# Altium schematic sheet Micro.SchDoc
size Letter
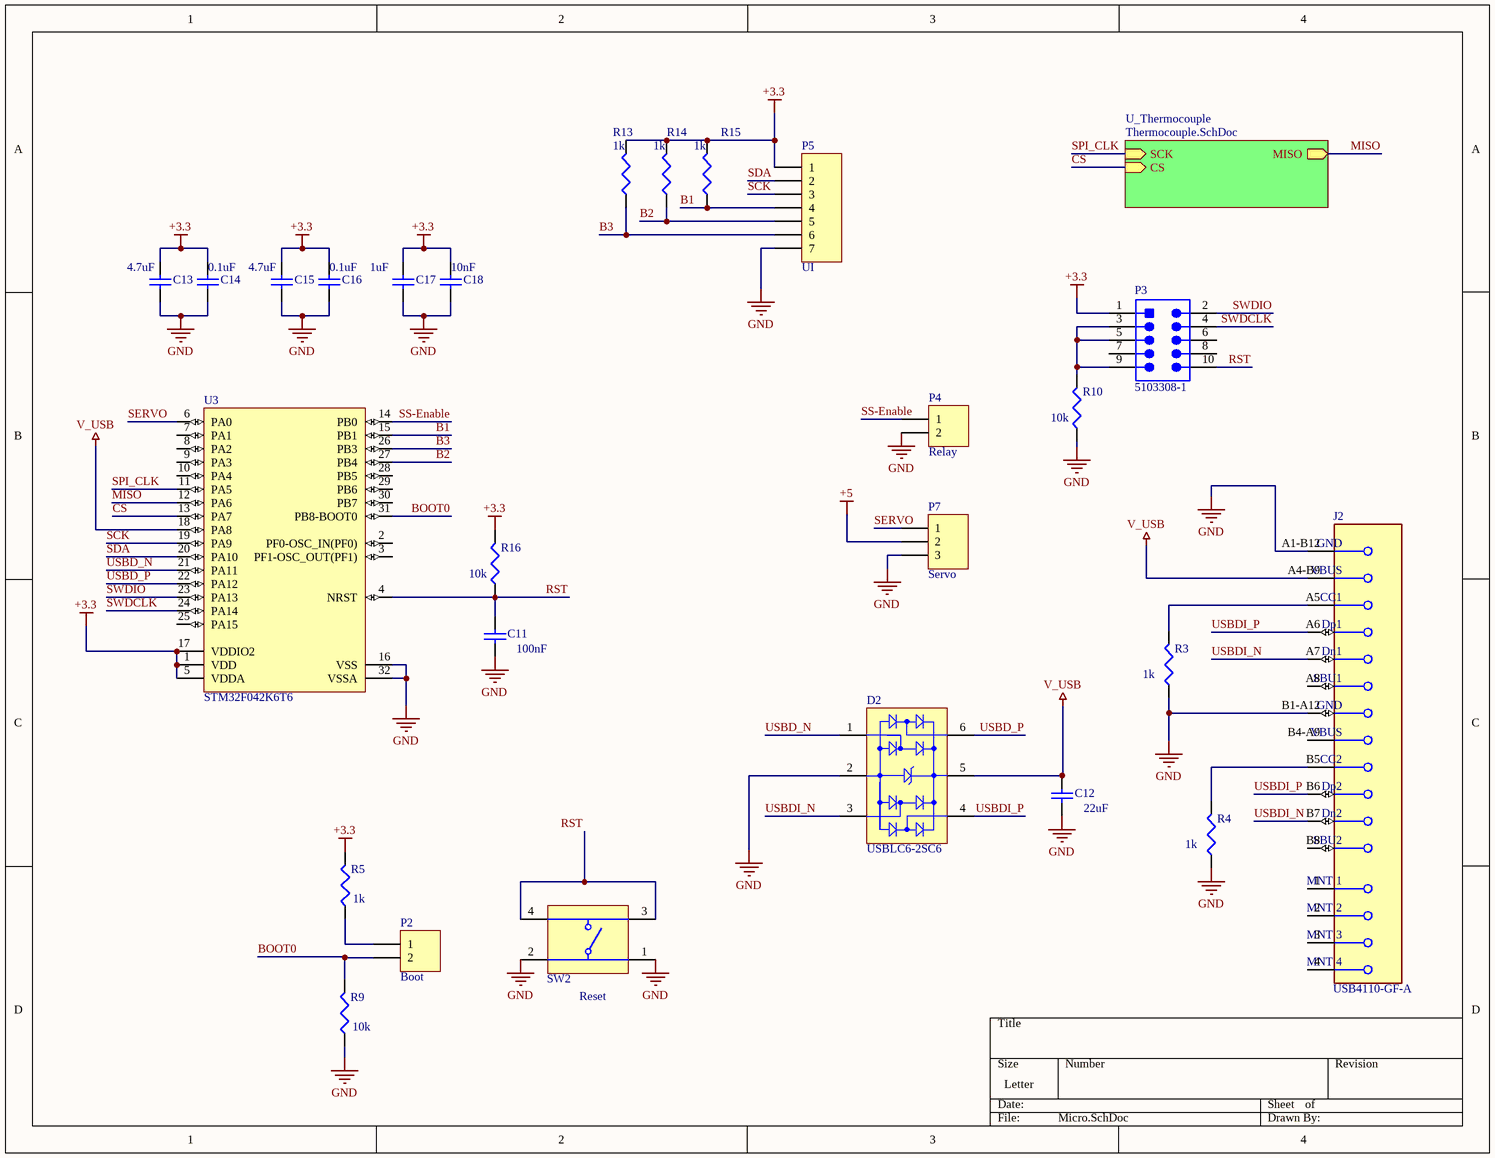
[diagram p0: Micro.SchDoc]

## Parts
C11  value 100nF  [1608[0603]]  (hidden comment: Cap Semi)
C12  value 22uF  [1608[0603]]  (hidden comment: Cap Semi)
C13  value 4.7uF  [1608[0603]]  (hidden comment: Cap Semi)
C14  value 0.1uF  [1608[0603]]  (hidden comment: Cap Semi)
C15  value 4.7uF  [1608[0603]]  (hidden comment: Cap Semi)
C16  value 0.1uF  [1608[0603]]  (hidden comment: Cap Semi)
C17  value 1uF  [1608[0603]]  (hidden comment: Cap Semi)
C18  value 10nF  [1608[0603]]  (hidden comment: Cap Semi)
D2  USBLC6-2SC6  [STM-SOT23-6L_V]
J2  USB4110-GF-A  [FP-USB4110-GF-A-MFG]
P2  Boot  [HDR1X2]
P3  5103308-1  [TECO-5103308-1_V]
P4  Relay  [HDR1X2H]
P5  UI  [HDR1X7H]
P7  Servo  [HDR1X3H]
R3  value 1k  [J1-0603]  (hidden comment: Res3)
R4  value 1k  [J1-0603]  (hidden comment: Res3)
R5  value 1k  [J1-0603]  (hidden comment: Res3)
R9  value 10k  [J1-0603]  (hidden comment: Res3)
R10  value 10k  [J1-0603]  (hidden comment: Res3)
R13  value 1k  [J1-0603]  (hidden comment: Res3)
R14  value 1k  [J1-0603]  (hidden comment: Res3)
R15  value 1k  [J1-0603]  (hidden comment: Res3)
R16  value 10k  [J1-0603]  (hidden comment: Res3)
SW2  Reset  [CKCP-PTS525SM10SMTR-4_V]
U3  STM32F042K6T6  [STM-LQFP32_M]

## Sub-sheets
U_Thermocouple = Thermocouple.SchDoc: SCK (in), MISO (out), CS (in)

## Nets
+3.3: C13.2 C14.2 C15.2 C16.2 C17.2 C18.2 P3.1 P5.1 R5.2 R13.2 R14.2 R15.2 R16.2 U3.1(VDD) U3.5(VDDA) U3.17(VDDIO2)
+5: P7.2
GND: C11.1 C12.1 C13.1 C14.1 C15.1 C16.1 C17.1 C18.1 D2.2(GND) J2.A1-B12(GND) J2.B1-A12(GND) P4.2 P5.7 P7.3 R3.1 R4.1 R9.1 R10.1 SW2.1 SW2.2 U3.16(VSS) U3.32(VSSA)
V_USB: C12.2 D2.5(VBUS) J2.A4-B9(VBUS) U3.18(PA8)
B1: P5.4 R15.1 U3.15(PB1)
B2: P5.5 R14.1 U3.27(PB4)
B3: P5.6 R13.1 U3.26(PB3)
BOOT0: P2.2 R9.2 U3.31(PB8-BOOT0)
CS: U3.13(PA7) ; sheet U_Thermocouple/CS
MISO: U3.12(PA6) ; sheet U_Thermocouple/MISO
RST: C11.2 P3.10 R16.1 SW2.3 SW2.4 U3.4(NRST)
SCK: P5.3 U3.19(PA9)
SDA: P5.2 U3.20(PA10)
SERVO: P7.1 U3.6(PA0)
SPI_CLK: U3.11(PA5) ; sheet U_Thermocouple/SCK
SS-Enable: P4.1 U3.14(PB0)
SWDCLK: P3.4 U3.24(PA14)
SWDIO: P3.2 U3.23(PA13)
USBD_N: D2.1(I/O_1) U3.21(PA11)
USBD_P: D2.6(I/O_4) U3.22(PA12)
USBDI_N: D2.3(I/O_2) J2.A7(Dn1) J2.B7(Dn2)
USBDI_P: D2.4(I/O_3) J2.A6(Dp1) J2.B6(Dp2)
NetJ2_A5: J2.A5(CC1) R3.2
NetJ2_B5: J2.B5(CC2) R4.2
NetP2_1: P2.1 R5.1
NetP3_3: P3.3 P3.5 P3.9 R10.2

Not connected (* = marked no-connect by the designer): J2 1(MNT_1) 2(MNT_2) 3(MNT_3) 4(MNT_4) A8(SBU1) B4-A9(VBUS) B8(SBU2); P3 6 7 8; U3 2(PF0-OSC_IN(PF0)) 3(PF1-OSC_OUT(PF1)) 7(PA1) 8(PA2) 9(PA3) 10(PA4) 25(PA15) 28(PB5) 29(PB6) 30(PB7)

## Library data of the parts
C11 C12 = Cap Semi_3: Capacitor (Semiconductor SIM Model); Published: 8-Jun-2000; LatestRevisionDate: 29-May-2009; LatestRevisionNote: IPC-7351 Footprint Added.; PackageReference: C1206; Publisher: Altium Limited; PackageDescription: Chip Capacitor; LCSC Part #: C14663
C13 C15 C17 = Cap Semi_1: Capacitor (Semiconductor SIM Model); Published: 8-Jun-2000; LatestRevisionDate: 29-May-2009; LatestRevisionNote: IPC-7351 Footprint Added.; PackageReference: C1206; Publisher: Altium Limited; PackageDescription: Chip Capacitor; LCSC Part #: C15849
C14 C16 C18 = Cap Semi_2: Capacitor (Semiconductor SIM Model); Published: 8-Jun-2000; LatestRevisionDate: 29-May-2009; LatestRevisionNote: IPC-7351 Footprint Added.; PackageReference: C1206; Publisher: Altium Limited; PackageDescription: Chip Capacitor; LCSC Part #: C15195
D2 = CMP-2000-05378-1: Very low capacitance ESD protection, 3.5 pF, -40 to 125 degC, 6-Pin SOT23, RoHS, Tape and Reel; Manufacturer: STMicroelectronics; Polarity: Uni-Directional; Clamping Voltage: 17V; Rad Hardened: No; Product Height (mm): 1.3mm; Leakage Current (Max): 0.15uA; Product Length (mm): 3.05mm; Number of Elements: 1; Peak Pulse Current: 5A; Configuration: Dual; Reverse Breakdown Voltage: 6V; Working Voltage (Max): 5V; Capacitance Value: 3.5pF; Suppressor Type: DiodeArrays; Product Depth (mm): 1.75mm; Test Current (It): 1mA; Package / Case: SOT-23; Operating Temperature Max Deg. C: 125C; Package Description: 6-Pin Small Outline Transistor, Body 2.925 x 1.625 mm, Pitch 0.95 mm; Package Reference: SOT23-6L; Datasheet Version: Rev. 5, 10/2011; Operating Temperature Min Deg. C: -40C; Mounting Style: SurfaceMount; Direction Type: Uni-Directional; Mounting: SurfaceMount; Pin Count: 6; Leakage Current: 0.15uA; Packaging: TapeandReel; Operating Temperature Classification: Automotive; Clamping Voltage (Max): 17V; Manufacturer URL: http://www.st.com/; Reverse Stand-off Voltage: 5V; Datasheet URL: http://www.st.com/st-web-ui/static/active/en/resource/technical/document/datasheet/CD00050750.pdf; Working Voltage: 5V; Operating Temp Range: -40Cto125C
J2 = CMP-245163-000002-1: CONN USB 2.0 TYPE-C R/A SMT; Manufacturer: GCT; Conn Orientation: Right Angle; Usb Standard: USB 2.0; Voltage Rating: 20V; Current Rating: 3/4.25/1.25/0.25A; Number Of Contacts: 16; Is Female: yes; Shielding: true; Standoff Height: 0.1mm; Octopart: https://octopart.com/usb4110-gf-a-gct-103941985; Temperature: -40°C to +85°C; RoHS: TRUE; Automotive: No; Contact Material: Gold,Nickel; Device Class L1: Connectors; Device Class L2: USB Connectors; Package: 0; Lead Free: Yes; ComponentLink2URL: https://gct.co/files/drawings/usb4110.pdf; Temperature Range High: +85°C; Temperature Range Low: -40°C; Height: 3.46mm; Manufacturer Part Number: USB4110-GF-A; ComponentLink2Description: Datasheet; Device Class L3: unset; Digikey Description: CONN USB 2.0 TYPE-C R/A SMT; Category: Conn
P2 = Header 2: Header, 2-Pin; LatestRevisionDate: 17-Jul-2002; LatestRevisionNote: Re-released for DXP Platform.; Publisher: Altium Limited
P3 = CMP-2000-05416-1: Male Header, Pitch 2.54 mm, 2 x 5 Position, Height 9.85 mm, Tail Length 3.05 mm, RoHS, Tube; Manufacturer: TE Connectivity; Pitch: 0.100"(2.54mm); Mating Products: 1658624-1-ND / -CONNRCPT10POSPOLARGOLD / 1658527-4-ND / -CONNRCPT10POS.100W/STRRELF / 1658527-3-ND / -CONNRCPT10POS.100622SERIES / 1658526-3-ND / -CONNRCPT10POSVERTGOLD / 1658526-5-ND / -609-1041LFFEMSOCKT,LEADFREE / 1658526-4-ND / -609-1030LFFEMSOCKT,LEADFREE / ASC10B-ND / -CONNIDCSOCKET10POSGOLD / ASC10H-ND / -CONNIDCSOCKET10POS15GOLD / AKC10B-ND / -CONNIDCSKT10POSW/POLGOLD / AKC10H-ND / -CONNIDCSKT10POSW/POL15GOLD / More...; Dynamic Catalog: AMP-LatchSeries; Number of Positions Loaded: All; Featured Product: AMP-LATCHRibbonCableConnectors; 3D Model: 5103308-1.pdf; Number of Positions: 10; Other Names: A33159; Catalog Drawings: LowProfileShroudedStraight; Connector Type: Header,Shrouded; Termination: Solder; Contact Finish Thickness: 15µin(0.38µm); Datasheet URL: http://www.onlinecomponents.com/productFiles/mf-AMP/eng_cat_889409_0699_96_.pdf; Standard Package: 125; Number of Rows: 2; Contact Type: MalePin; Mounting Type: ThroughHole; Manufacturer URL: http://www.te.com/; Contact Finish: GoldorGold-Palladium; Family: RectangularConnectors-Headers,MalePins; RoHS Information: 5103308-1StatementofCompliance; Packaging: Tube; Category: Connectors,Interconnects; Datasheet Version: Apr-12; Contact Mating Length: 0.240"(6.10mm); Series: AMP-Latch; Row Spacing: 0.100"(2.54mm); Color: Black
P4 = Header 2H: Header, 2-Pin, Right Angle; LatestRevisionDate: 17-Jul-2002; LatestRevisionNote: Re-released for DXP Platform.; Publisher: Altium Limited
P5 = Header 7H: Header, 7-Pin, Right Angle; LatestRevisionDate: 17-Jul-2002; LatestRevisionNote: Re-released for DXP Platform.; Publisher: Altium Limited
P7 = Header 3H: Header, 3-Pin, Right Angle; LatestRevisionDate: 17-Jul-2002; LatestRevisionNote: Re-released for DXP Platform.; Publisher: Altium Limited
R3-R5 R9 R10 R13-R16 = Res3_2: Resistor; Published: 8-Jun-2000; LatestRevisionDate: 29-May-2009; LatestRevisionNote: IPC-7351 Footprint Added.; PackageReference: J1-0603; Publisher: Altium Limited; PackageDescription: Chip Resistor; LCSC Part #: C25804
SW2 = CMP-2000-05088-1: Microminiature Tact Switch, SPST-NO, 50 mA, 12 VDC, -40 to 60 degC, 4-Pin SMD, RoHS, Tape and Reel; Part No: PTS525SM10SMTRLFS; Manufacturer: C&K Components; Maximum DC Voltage Rating: 12V; Body Orientation: Straight; Dielectric Strength: 250VAC; Pole Throw Configuration: SPST; Operating Force: 1.57N; Minimum Insulation Resistance: 100000MOhm; Actuator Length: 0.3mm; Base Material: Nylon6/6,Glass/Polyester; Switch Configuration: N.O.; Contact Rating @ Voltage: 0.05@12VDCA; Ground Terminal: No; Mechanical Life: 100000Cycles; Actuator Style: RoundButton; Illumination Type: N/R; Maximum Contact Resistance: 100mOhm; Datasheet Version: Apr-09; Contact Material: PhosphorBronze; Dimension: 5.25x6.4x1.5mm; Family: PTS525; Type: N/A; Seal Description: N/A; Mounting: SurfaceMount,GullWing; Product Weight: N/A; Seal Location: N/A; Electrical Life: N/A; Manufacturer URL: http://www.ckswitches.com/; Datasheet URL: https://datasheet.ciiva.com/18145/getdatasheetpartid-226915-18145102.pdf; Maximum AC Voltage Rating: N/A; Supplier: C&KComponents; HTS: 8536501199; Contact Plating: SilverClad; Actuator Color: N/A; Operating Temperature: -40to60C; ECCN: EAR99; Supplier Standard Pack: 3,000; RoHS: Yes; Housing Material: N/A; Packaging: TapeandReel
U3 = CMP-0304-00114-2: ARM Cortex-M0 32-bit MCU, 32 KB Flash, 6 KB Internal RAM, 28 I/Os, 32-Pin LQFP, -40 to 85 degC, Tray; Manufacturer: STMicroelectronics; Operating Frequency(F) (Processor speed) (MHz): 48; Internal RAM Size (kB): 6; Supply Voltage(Vcc) min (V): 2; I/Os (High Current): 28; FLASH Size (Prog) (kB): 32; ComponentLink1Description: Manufacturer URL; Package Reference: LQFP32; ComponentLink2Description: Datasheet; ComponentLink1URL: http://www.st.com/; Core: ARM Cortex-M0; DatasheetVersion: Rev. 5; ComponentLink2URL: http://www.st.com/st-web-ui/static/active/en/resource/technical/document/datasheet/DM00105814.pdf; Packing: Tray; Package Description: 32-Pin Low Profile Quad Flat Package, 7 x 7 mm Body, 0.8 mm Pitch; PartNumber: STM32F042K6T6; Mounting Technology: Surface Mount